# EAGLE design balloon3.2 (EAGLE 7.3.0)
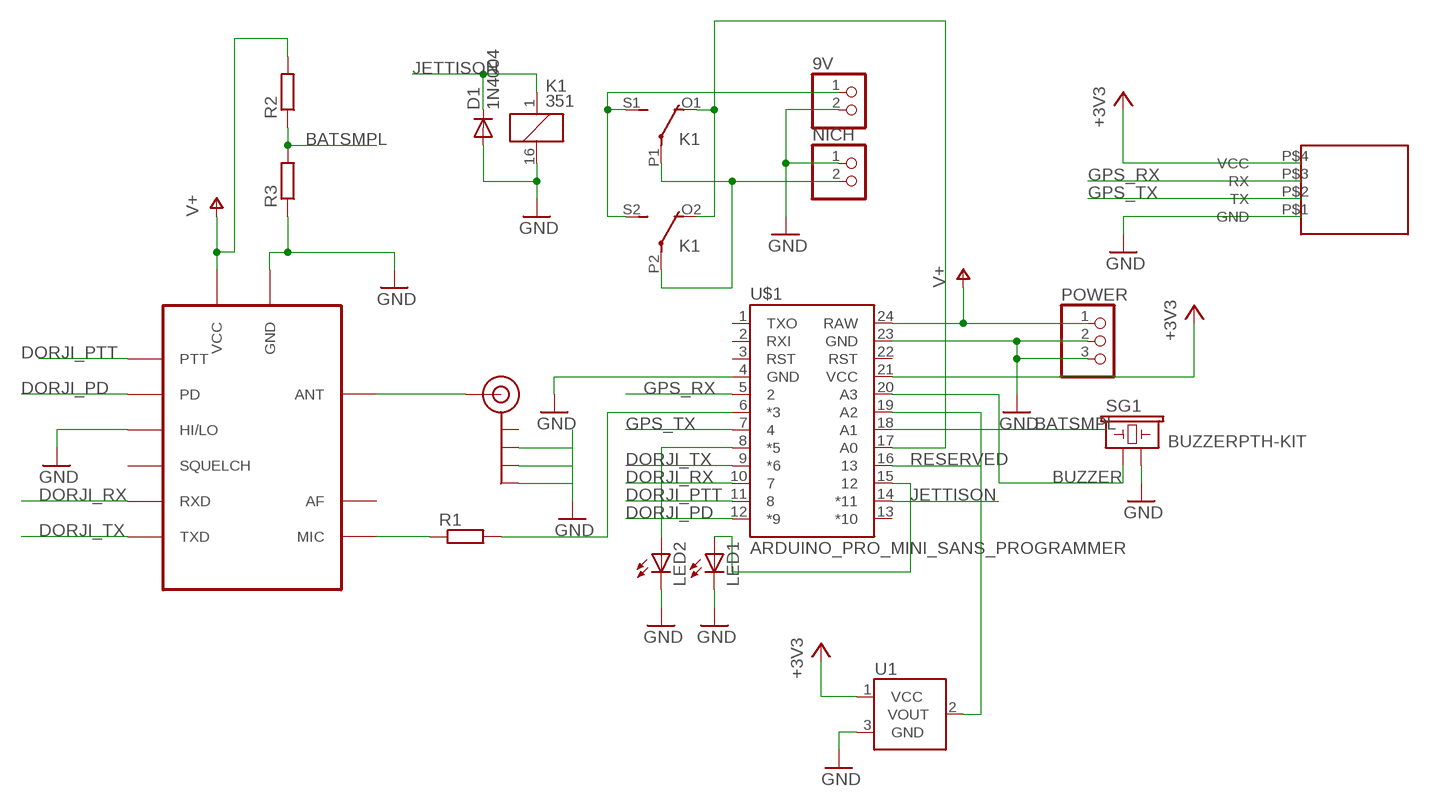
[diagram p0: schematic, sheet 1]

## Parts
9V  PINHD-1X2  [1X02]
D1  1N4004  [DO41-10]
J$1  SMA_EDGE  [SMA-EDGE]
K1  351  [351]
LED1  LED3MM  [LED3MM]
LED2  LED3MM  [LED3MM]
NICH  PINHD-1X2  [1X02]
POWER  PINHD-1X3  [1X03]
R1  R-EU_0204/7  [0204/7]
R2  R-EU_0204/7  [0204/7]
R3  R-EU_0204/7  [0204/7]
SG1  BUZZERPTH-KIT  [BUZZER-12MM-KIT]
U1  TMP36GT9  [TO-92]
U$1  ARDUINO_PRO_MINI_SANS_PROGRAMMER  [ARDUINO_PRO_MINI]
U$2  DORJI  [DORJI]
U$3  NEO-6M-MODULE  [NEO-6M-MODULE]

## Nets
+3V3: U1.1(VCC) U$1.21(VCC) U$3.P$4(VCC)
BATSMPL: R2.1 R3.2 U$1.18(A1)
BUZZER: SG1.+ U$1.20(A3)
DORJI_PD: U$1.12(*9) U$2.P$6(PD)
DORJI_PTT: U$1.11 U$2.P$5(PTT)
DORJI_RX: U$1.10 U$2.P$16(RXD)
DORJI_TX: U$1.9(*6) U$2.P$17(TXD)
GND: 9V.2 D1.A J$1.GND@1(GND) J$1.GND@2(GND) J$1.GND@3(GND) K1.16 LED1.K(C) LED2.K(C) NICH.1 POWER.2 POWER.3 R3.1 SG1.- U1.3(GND) U$1.4(GND) U$1.23(GND) U$2.P$7(HI/LO) U$2.P$9(GND) U$2.P$10(GND) U$3.P$1(GND)
GPS_RX: U$1.5 U$3.P$3(RX)
GPS_TX: U$1.7 U$3.P$2(TX)
JETTISON: D1.C K1.1 U$1.14(*11)
N$1: R1.2 U$1.6(*3)
N$2: R1.1 U$2.P$18(MIC)
N$3: J$1.SIG(SIGNAL) U$2.P$12(ANT)
N$4: K1.P1(2:P) K1.P2(3:P) NICH.2
N$5: LED2.A U$1.8(*5)
N$6: 9V.1 K1.S1(2:S) K1.S2(3:S)
N$7: K1.O1(2:O) K1.O2(3:O) U$1.17(A0)
N$8: U1.2(VOUT) U$1.19(A2)
N$9: LED1.A U$1.15
RESERVED: U$1.16
V+: POWER.1 R2.2 U$1.24(RAW) U$2.P$8(VCC)
Unconnected: J$1.GND@0(GND) U$1.1(TXO) U$1.2(RXI) U$1.3(RST) U$1.13(*10) U$1.22(RST) U$2.P$1(SQUELCH) U$2.P$3(AF)

## Library data of the parts
9V NICH = pinhead:PINHD-1X2: PIN HEADER
D1 = diode:1N4004: DIODE general purpose rectifier, 1 A
J$1 = SparkFun-Connectors:SMA_EDGE: SMA Antenna Connector End launch SMA connector. The paste layer has been removed so that the connector can be hand soldered onto the board after reflow.
K1 = relay:351: RELAY 2 x switch, Omron; OC_FARNELL: unknown; OC_NEWARK: unknown
LED1 LED2 = adafruit:LED: LED OSRAM: - CHIPLED LG R971, LG N971, LY N971, LG Q971, LY Q971, LO R971, LY R971 LH N974, LH R974 LS Q976, LO Q976, LY Q976 LO Q996 - Hyper CHIPLED LW Q18S LB Q993, LB Q99A, LB R99A - SideLED LS A670, LO A670, LY A670, LG A670, LP A670 LB A673, LV A673, LT A673, LW A673 LH A674 LY A675 LS A676, LA A676, LO A676, LY A676, LW A676 LS A679, LY A679, LG A679 - Hyper Micro SIDELED® LS Y876, LA Y876, LO Y876, LY Y876 LT Y87S - SmartLED LW L88C, LW L88S LB L89C, LB L89S, LG L890 LS L89K, LO L89K, LY L89K LS L896, LA L896, LO L896, LY L896 - TOPLED LS T670, LO T670, LY T670, LG T670, LP T670 LSG T670, LSP T670, LSY T670, LOP T670, LYG T670 LG T671, LOG T671, LSG T671 LB T673, LV T673, LT T673, LW T673 LH T674 LS T676, LA T676, LO T676, LY T676, LB T676, LH T676, LSB T676, LW T676 LB T67C, LV T67C, LT T67C, LS T67K, LO T67K, LY T67K, LW E67C LS E67B, LA E67B, LO E67B, LY E67B, LB E67C, LV E67C, LT E67C LW T67C LS T679, LY T679, LG T679 LS T770, LO T770, LY T770, LG T770, LP T770 LB T773, LV T773, LT T773, LW T773 LH T774 LS E675, LA E675, LY E675, LS T675 LS T776, LA T776, LO T776, LY T776, LB T776 LHGB T686 LT T68C, LB T68C - Hyper Mini TOPLED® LB M676 - Mini TOPLED Santana® LG M470 LS M47K, LO M47K, LY M47K Source: http://www.osram.convergy.de/
POWER = pinhead:PINHD-1X3: PIN HEADER
R1-R3 = resistor:R-EU_: RESISTOR, European symbol
SG1 = SparkFun-Electromechanical:BUZZER: Buzzer 12mm Spark Fun Electronics SKU : Comp-Buzzer; PROD_ID: COMP-08253
U1 = SparkFun-Sensors:TMP36: Precision degC temp sensor, analog out
U$1 = ido:ARDUINO_PRO_MINI_SANS_PROGRAMMER
U$2 = dorji:DORJI: DRA818V 2-Meter transceiver modul
U$3 = ido:NEO-6M-MODULE

## Board
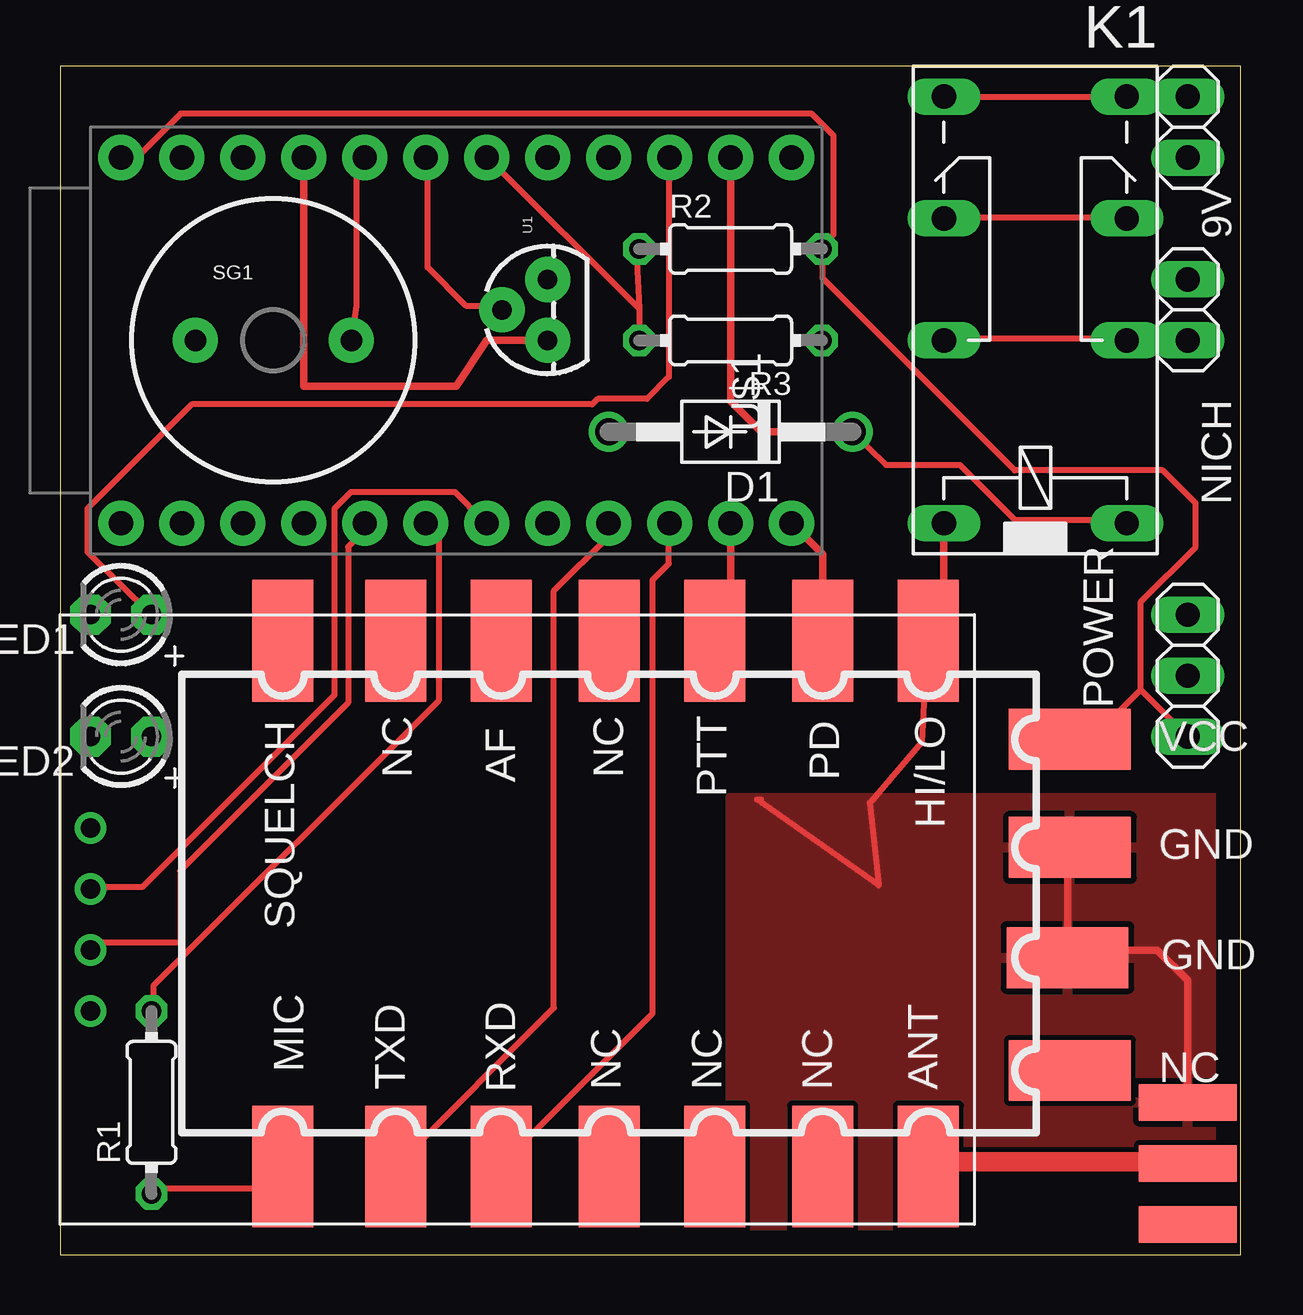
[diagram p1: board, top side]
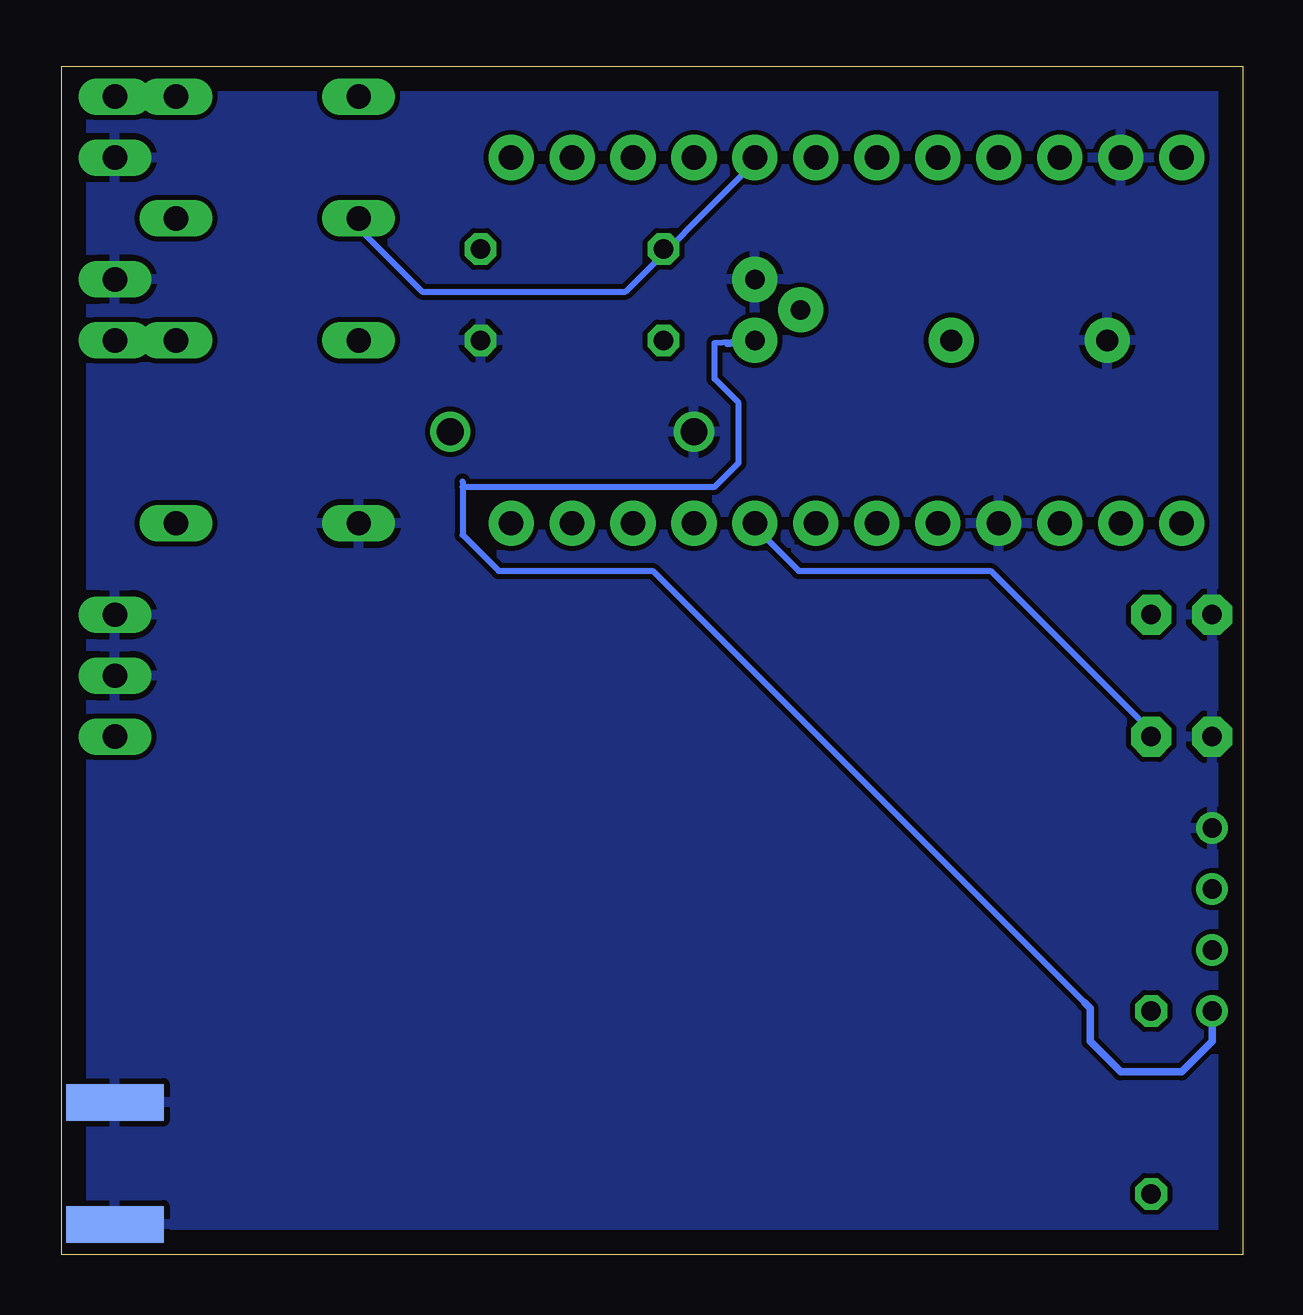
[diagram p2: board, bottom side, seen from below]

Size 49.2 x 49.52 mm. Coordinates in mm from the lower left corner, seen from the top.
Outline: 0,0 49.2,0 49.2,49.52 0,49.52 0,0
Copper layers (1*16): Top 0.035mm / dielectric 1.5mm / Bottom 0.035mm
Design rules "default": minimum track width 10mil, minimum drill 24mil, track to track 8mil, track to pad 8mil, pad to pad 8mil, via to via 8mil, smd to smd 8mil, copper to edge 40mil, drill to drill 8mil, minimum pad ring 10mil, minimum via ring 8mil, stop-mask expansion 4mil, vias tented up to drill 0mil, thermal gap 10mil

### Footprints (pad centres in the part's own frame; a part is rotated, then mirrored left to right if it is on the bottom)
1X02 = drill 1.016 long: 1 -1.27,0; 2 1.27,0
DO41-10 = drill 1.118: A 5.08,0; C -5.08,0
SMA-EDGE = smd 1.524 x 4.064: GND@0 0,0; GND@1 5.08,0; SIG 2.54,0 | smd 1.524 x 4.064 bottom: GND@2 0,0; GND@3 5.08,0
351 = drill 1.016 long: 1 -3.81,-3.81; 16 -3.81,3.81; O1 8.89,-3.81; O2 8.89,3.81; P1 3.81,-3.81; P2 3.81,3.81; S1 13.97,-3.81; S2 13.97,3.81
LED3MM = drill 0.813 pad 1.676 octagon: A -1.27,0; K 1.27,0
1X03 = drill 1.016 long: 1 -2.54,0; 2 0,0; 3 2.54,0
0204/7 = drill 0.813 octagon: 1 -3.81,0; 2 3.81,0
BUZZER-12MM-KIT = drill 0.9 pad 1.88: + 3.25,0; - -3.25,0
TO-92 = drill 0.813 pad 1.88: 1 -1.27,0; 2 0,1.905; 3 1.27,0
ARDUINO_PRO_MINI = drill 1.016 pad 1.88: 1 1.27,29.21; 2 1.27,26.67; 3 1.27,24.13; 4 1.27,21.59; 5 1.27,19.05; 6 1.27,16.51; 7 1.27,13.97; 8 1.27,11.43; 9 1.27,8.89; 10 1.27,6.35; 11 1.27,3.81; 12 1.27,1.27; 13 16.51,1.27; 14 16.51,3.81; 15 16.51,6.35; 16 16.51,8.89; 17 16.51,11.43; 18 16.51,13.97; 19 16.51,16.51; 20 16.51,19.05; 21 16.51,21.59; 22 16.51,24.13; 23 16.51,26.67; 24 16.51,29.21
DORJI = smd 2.54 x 5.08: P$1 4.2,20.5; P$2 8.9,20.5; P$3 13.3,20.5; P$4 17.8,20.5; P$5 22.2,20.5; P$6 26.7,20.5; P$7 31.1,20.5; P$12 31.1,-1.4; P$13 26.7,-1.4; P$14 22.2,-1.4; P$15 17.8,-1.4; P$16 13.3,-1.4; P$17 8.9,-1.4; P$18 4.2,-1.4 | smd 5.08 x 2.54: P$8 37,16.4; P$9 37,11.9; P$10 36.9,7.3; P$11 37,2.6
NEO-6M-MODULE = drill 0.8: P$1 1.27,16.51; P$2 1.27,13.97; P$3 1.27,11.43; P$4 1.27,8.89

### Placement (x,y rotation side)
9V  46.99,46.99 270 top
D1  27.94,34.29 180 top
J$1  46.99,1.27 90 top
K1  40.64,34.29 90 top
LED1  2.54,26.67 180 top
LED2  2.54,21.59 180 top
NICH  46.99,39.37 270 top
POWER  46.99,24.13 90 top
R1  3.81,6.35 90 top
R2  27.94,41.91 0 top
R3  27.94,38.1 180 top
SG1  8.89,38.1 0 top
U1  20.32,39.37 90 top
U$1  31.75,29.21 90 top
U$2  5.08,5.08 0 top
U$3  0,1.27 0 top

### Tracks (layer width: path | path; a pad name or v marks a point on that pad's centre or on a via)
+3V3
  Top 0.305: U1.1 17.78,38.1 16.51,36.2 10.16,36.2 U$1.21
  Bottom 0.254: 6.58,10.5 24.58,28.5 31,28.5 32.5,30 32.5,32 | 32.5,32.23 32.5,32 | 21.49,37.95 U1.1 22,38 22,36.5 21,35.5 21,33 22,32 32.5,32
  Bottom 0.305: U$3.P$4 1.27,8.89 2.54,7.62 5.08,7.62 6.35,8.89 6.35,10.27 6.58,10.5
BATSMPL
  Top 0.254: 24.13,39.42 R3.2 | 24.13,39.42 24,41.83 R2.1 | 24.13,39.42 17.83,45.72 U$1.18
BUZZER
  Top 0.254: SG1.+ 12.34,39.55 12.34,45.49 12.57,45.72 U$1.20
DORJI_PD
  Top 0.305: U$2.P$6 31.78,29.18 U$1.12
DORJI_PTT
  Top 0.305: U$1.11 27.94,26.24 U$2.P$5
DORJI_RX
  Top 0.254: U$1.10 25.38,30.4 25.38,28.8 24.69,28.12 24.69,10.06 18.52,3.89 U$2.P$16
DORJI_TX
  Top 0.254: U$1.9 22.86,29.95 20.57,27.66 20.57,10.29 14.17,3.89 U$2.P$17
GND
  Top 0.254: 29.21,18.97 29.03,18.97 34.11,15.39 33.73,18.82 35.92,21.36 36.12,25.38 U$2.P$7
  Top 0.305: K1.16 36.83,26.23 U$2.P$7 | J$1.GND@1 46.99,11.43 45.72,12.7 42.3,12.7 U$2.P$10 41.98,16.88 U$2.P$9
  pour Bottom: 0,0 0,49.53 49.53,49.53 49.53,0
  pour Top: 27.94,0 27.94,19.05 49.53,19.05 49.53,0
GPS_RX
  Top 0.254: U$3.P$3 1.5,13 5,13 5,16 12,23 12,29.5 12.5,30 U$1.5
GPS_TX
  Top 0.254: U$3.P$2 1.37,15.32 3.43,15.32 11.43,23.32 11.43,31.09 12.12,31.77 16.46,31.77 17.6,30.63 U$1.7
JETTISON
  Top 0.254: K1.1 44.35,30.63 39.78,30.63 37.49,32.92 34.42,32.92 D1.C
  Top 0.305: U$1.14 27.94,35.56 29.21,34.29 D1.C
N$1
  Top 0.254: U$1.6 15.77,29.95 15.77,23.09 3.89,11.2 3.89,10.29 R1.2
N$2
  Top 0.254: R1.1 3.89,2.74 8.23,2.74 9.14,3.66 U$2.P$18
N$3
  Top 0.254: 46.86,3.89 J$1.SIG | 36.35,3.89 U$2.P$12
  Top 0.813: 36.35,3.89 46.86,3.89
N$4
  Top 0.254: K1.P2 37.03,38.18 44.35,38.18 K1.P1 44.58,38.18 46.86,38.18 NICH.2
N$5
  Bottom 0.254: LED2.A 4,22 10.5,28.5 18.5,28.5 20,30 U$1.8
N$6
  Top 0.254: K1.S2 37.03,48.23 44.35,48.23 K1.S1 44.58,48.23 46.86,48.23 9V.1
N$7
  Top 0.254: K1.O2 37.03,43.2 44.35,43.2 K1.O1
  Bottom 0.254: U$1.17 20.34,45.72 20.8,45.26 20.8,45.03 25.7,40.13 34.19,40.13 37.03,42.98 K1.O2
N$8
  Top 0.254: U$1.19 15.32,45.72 15.32,41.15 16.92,39.55 18.39,39.55 U1.2
N$9
  Top 0.254: LED1.A 1.14,29.29 1.14,31.09 5.49,35.43 22.17,35.43 22.4,35.66 24.46,35.66 25.38,36.58 25.38,45.72 U$1.15
V+
  Top 0.254: 45.03,23.55 45.03,27.2 47.32,29.49 47.32,31.32 45.95,32.69 39.78,32.69 31.77,40.69 31.77,41.83 R2.2 31.77,42.06 32.23,42.52 32.23,46.63 31.32,47.55 5.03,47.55 3.2,45.72 U$1.24 | POWER.1 45.03,23.55 | 45.03,23.55 42.98,21.49 42.29,21.49 U$2.P$8